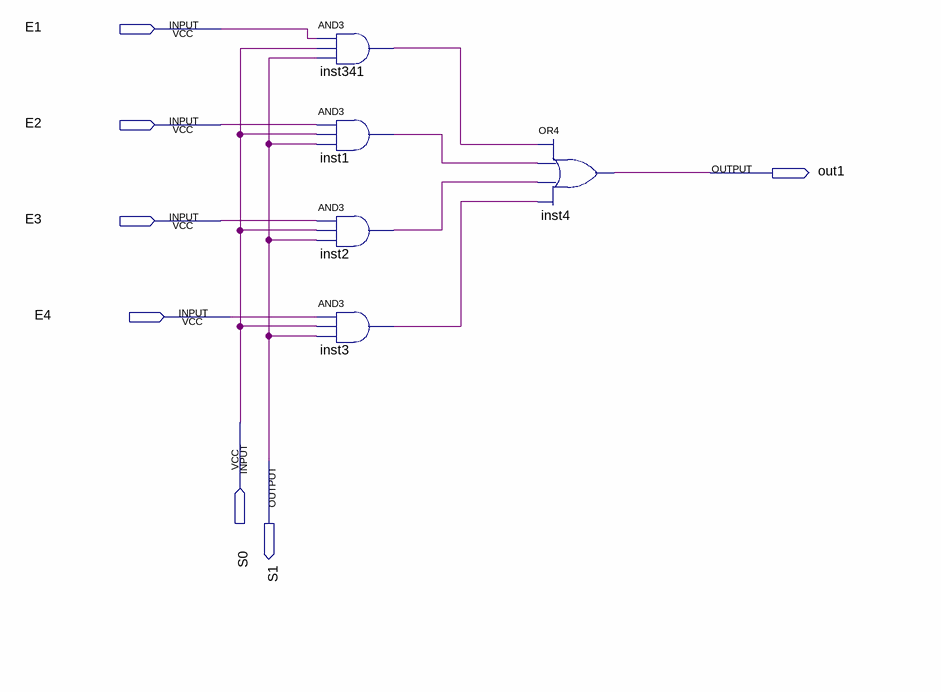
[diagram p0: schematic sheet]
// Quartus schematic multplex4-2.bdf as structural Verilog: 5 symbols, 7 pins
module \multplex4-2  (
  input  E1,
  input  E2,
  input  E3,
  input  E4,
  input  S0,
  output out1,
  output S1
);

  wire inst1_out, inst2_out, inst3_out, inst341_out;

  and inst341 (inst341_out, E1, S0, S1);
  and inst1 (inst1_out, E2, S0, S1);
  and inst2 (inst2_out, E3, S0, S1);
  and inst3 (inst3_out, E4, S0, S1);
  or inst4 (out1, inst341_out, inst1_out, inst2_out, inst3_out);
endmodule
